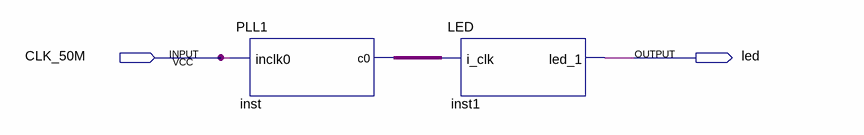
[diagram p0: schematic sheet]
// Quartus schematic LED_PLL.bdf as structural Verilog: 2 symbols, 2 pins
module LED_PLL (
  input  CLK_50M,
  output led
);

  wire inst_c0;

  PLL1 inst (.inclk0(CLK_50M), .c0(inst_c0));
  LED inst1 (.i_clk(inst_c0), .led_1(led));
endmodule
